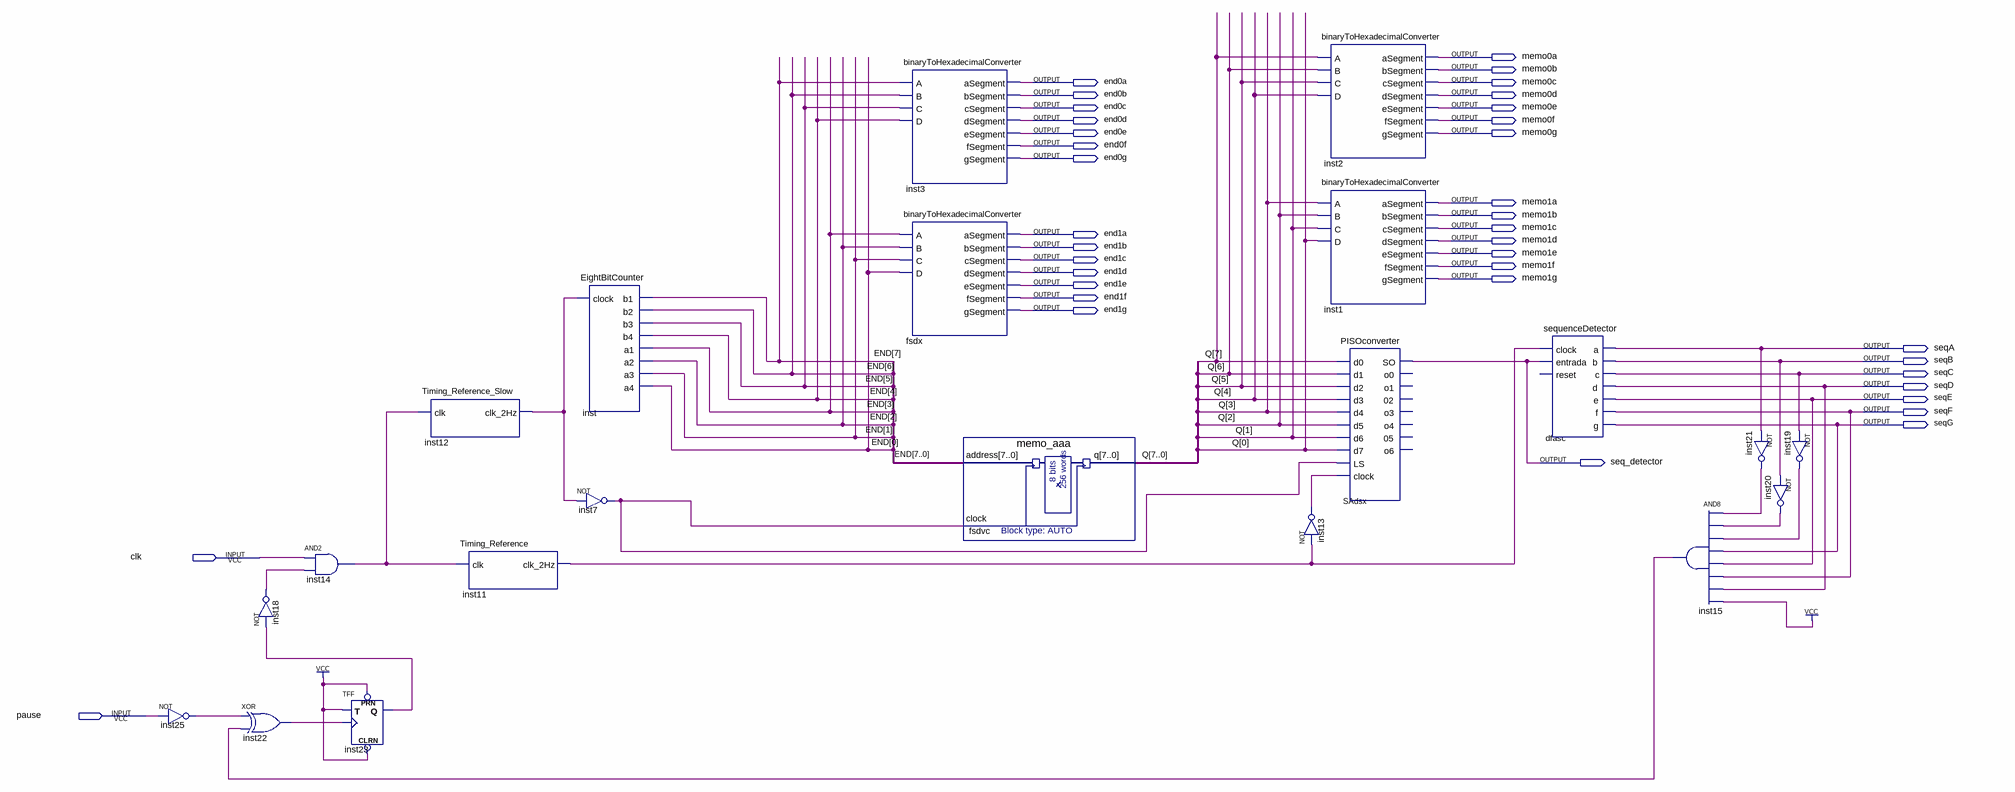
[diagram p0: schematic sheet]
// Quartus schematic memoriaLab7.bdf as structural Verilog: 21 symbols, 38 pins
module memoriaLab7 (
  input  clk,
  input  pause,
  output memo0a,
  output memo0b,
  output end0a,
  output memo0c,
  output end0b,
  output memo0d,
  output end0c,
  output memo0e,
  output end0d,
  output memo0f,
  output end0e,
  output memo0g,
  output end0f,
  output end0g,
  output memo1a,
  output memo1b,
  output memo1c,
  output end1a,
  output memo1d,
  output end1b,
  output memo1e,
  output end1c,
  output memo1f,
  output end1d,
  output memo1g,
  output end1e,
  output end1f,
  output end1g,
  output seqA,
  output seqB,
  output seqC,
  output seqD,
  output seqE,
  output seqF,
  output seqG,
  output seq_detector
);

  wire inst7_out, inst11_clk_2hz, inst12_clk_2hz, inst13_out, inst14_out, inst15_out, inst18_out, inst19_out,
       inst20_out, inst21_out, inst22_out, inst23_q, inst25_out;
  wire [7:0] END, Q;

  not inst25 (inst25_out, pause);
  not inst18 (inst18_out, inst23_q);
  xor inst22 (inst22_out, inst25_out, inst15_out);
  and inst14 (inst14_out, clk, inst18_out);
  TFF inst23 (.PRN(1'b1), .CLRN(1'b1), .T(1'b1), .CLK(inst22_out), .Q(inst23_q));
  Timing_Reference_Slow inst12 (.clk(inst14_out), .clk_2Hz(inst12_clk_2hz));
  Timing_Reference inst11 (.clk(inst14_out), .clk_2Hz(inst11_clk_2hz));
  EightBitCounter inst (
    .clock(inst12_clk_2hz), .b1(END[7]), .b2(END[6]), .b3(END[5]), .b4(END[4]), .a1(END[3]), .a2(END[2]),
    .a3(END[1]), .a4(END[0]));
  not inst7 (inst7_out, inst12_clk_2hz);
  binaryToHexadecimalConverter inst3 (
    .A(END[7]), .B(END[6]), .C(END[5]), .D(END[4]), .aSegment(end0a), .bSegment(end0b), .cSegment(end0c),
    .dSegment(end0d), .eSegment(end0e), .fSegment(end0f), .gSegment(end0g));
  binaryToHexadecimalConverter fsdx (
    .A(END[3]), .B(END[2]), .C(END[1]), .D(END[0]), .aSegment(end1a), .bSegment(end1b), .cSegment(end1c),
    .dSegment(end1d), .eSegment(end1e), .fSegment(end1f), .gSegment(end1g));
  memo_aaa fsdvc (.address(END), .clock(inst7_out), .q(Q));
  binaryToHexadecimalConverter inst2 (
    .A(Q[7]), .B(Q[6]), .C(Q[5]), .D(Q[4]), .aSegment(memo0a), .bSegment(memo0b), .cSegment(memo0c),
    .dSegment(memo0d), .eSegment(memo0e), .fSegment(memo0f), .gSegment(memo0g));
  binaryToHexadecimalConverter inst1 (
    .A(Q[3]), .B(Q[2]), .C(Q[1]), .D(Q[0]), .aSegment(memo1a), .bSegment(memo1b), .cSegment(memo1c),
    .dSegment(memo1d), .eSegment(memo1e), .fSegment(memo1f), .gSegment(memo1g));
  not inst13 (inst13_out, inst11_clk_2hz);
  PISOconverter SAdsx (
    .d0(Q[7]), .d1(Q[6]), .d2(Q[5]), .d3(Q[4]), .d4(Q[3]), .d5(Q[2]), .d6(Q[1]), .d7(Q[0]), .LS(inst7_out),
    .clock(inst13_out), .SO(seq_detector));  // open: o0, o1, 02, o3, o4, 05, o6
  sequenceDetector dfasc (
    .clock(inst11_clk_2hz), .entrada(seq_detector), .a(seqA), .b(seqB), .c(seqC), .d(seqD), .e(seqE),
    .f(seqF), .g(seqG));  // open: reset
  and inst15 (inst15_out, inst21_out, inst20_out, inst19_out, seqG, seqE, seqF, seqD, 1'b1);
  not inst21 (inst21_out, seqA);
  not inst20 (inst20_out, seqB);
  not inst19 (inst19_out, seqC);
endmodule
